# EasyEDA Pro project ProPrj_CAR BY HAO V1.3(no osd)_2026-07-17.epro, board PCB1
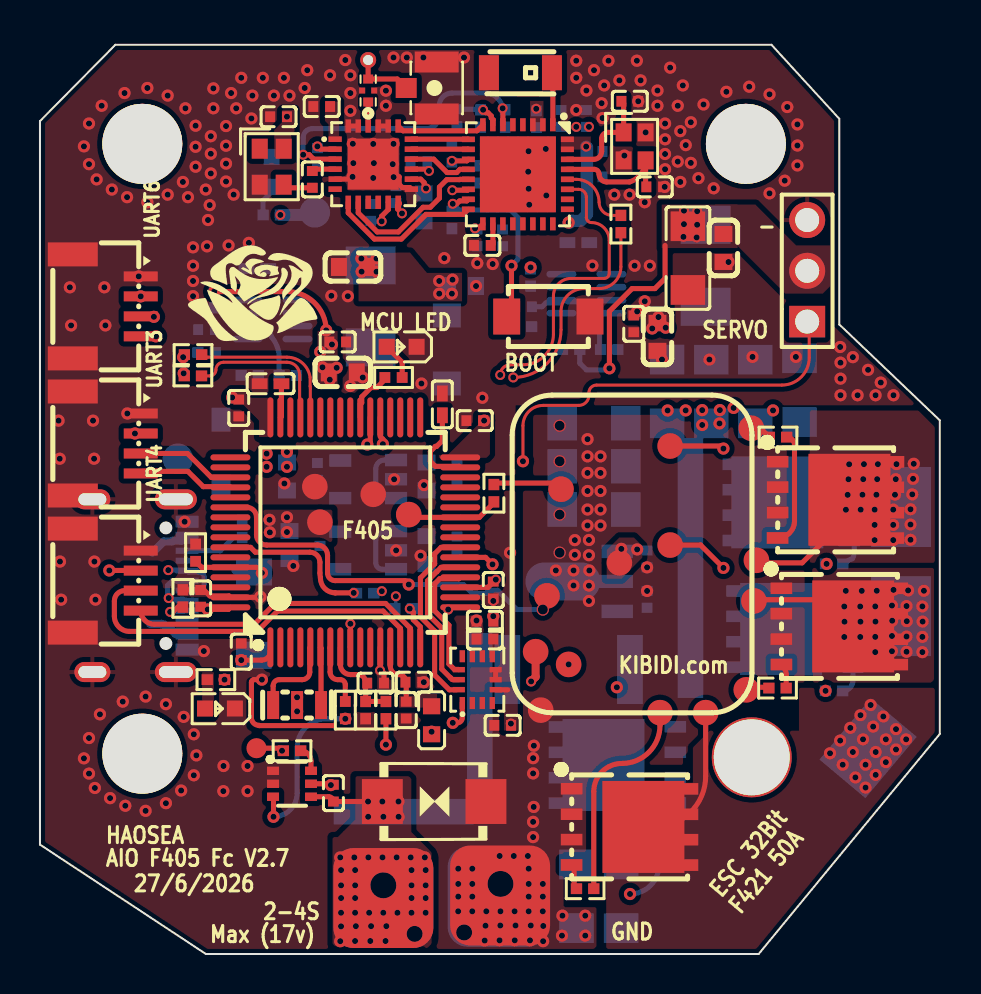
[diagram p6: board, top side]
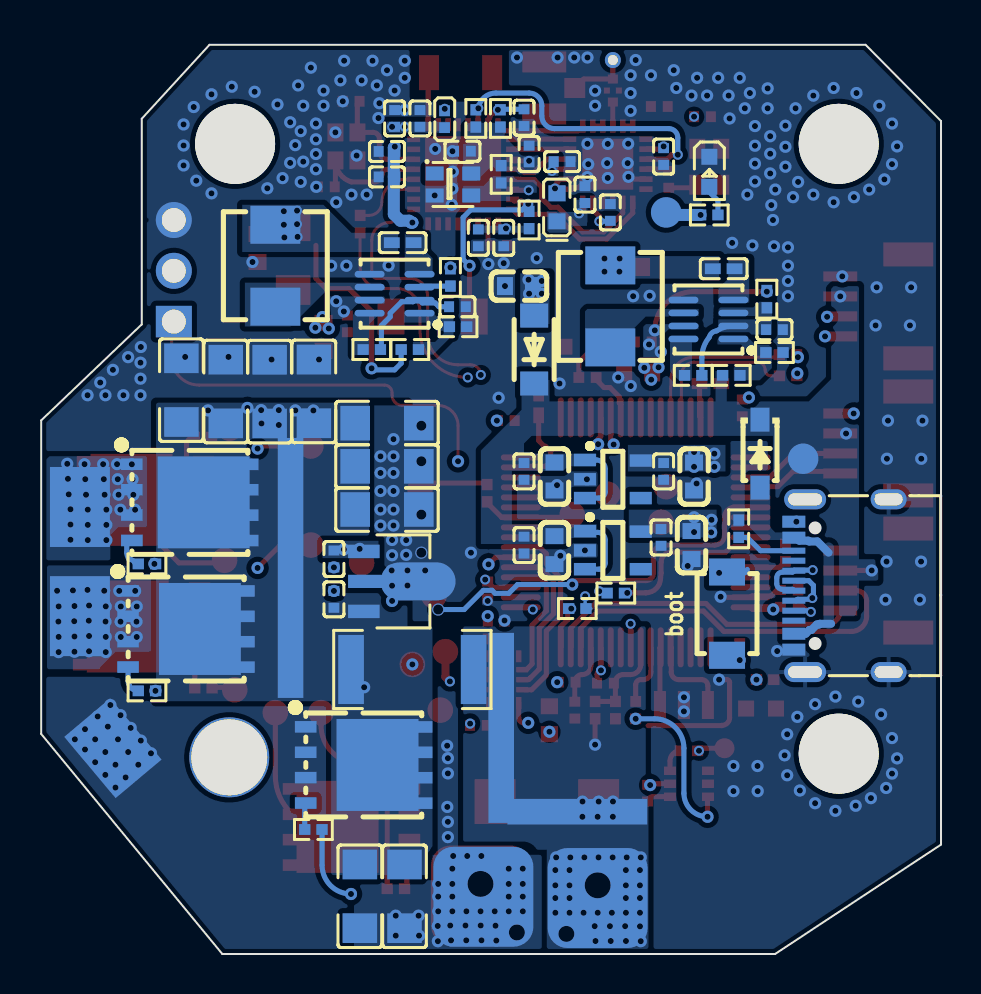
[diagram p7: board, bottom side, seen from below]

Outline 45.03 x 45.47 mm; copper layers: Top Layer, L2, L3, Bottom Layer. Coordinates in mm from the lower left corner of the outline.
Outline path: 0,41.66 3.77,45.47 36.61,45.47 40,41.77 40,31.49 45.03,26.69 45.03,11.01 35.97,0 8.3,0 0,5.47 0,41.66
Stack: Top Layer 0.035mm Outer layer thickness 1oz / Dielectric1 0.2104mm 7628 RC49% 8.6mil / L2 0.0152mm Inner layer thickness / Dielectric2 1.065mm 1.1mm H/HOZ Copper / L3 0.0152mm Inner layer thickness / Dielectric3 0.2104mm 7628 RC49% 8.6mil / Bottom Layer 0.035mm Outer layer thickness 1oz

## Design rules (mm)
template: Custom Config
spacing copperThickness1oz (default): track to track 0.102, other pairs 0.152 to 0.3
spacing copperThickness2oz: track to track 0.203, other pairs 0.152 to 0.3
track width copperThickness1oz (default): min 0.127, default 0.254, max 2.54
track width copperThickness2oz: min 0.203, default 0.254, max 2.54
differential pair differentialPair (default): width min 0.127, default 0.254, max 2.54; gap min 0.152, default 0.152
via viaSize (default): diameter min 0.5, default 0.61, max 10; hole min 0.3, default 0.305, max 6.3
net 4V-MCU uses PHU 100
net GND uses PHU 100
net VM uses PHU 100
net VS1 uses PHU 100
net VS2 uses PHU 100
net VS3 uses PHU 100
net 3.3V-MCU uses PHU 100
net VBAT uses PHU 100
net 3.3V-ESP32 uses PHU 100
pour e1156 uses PHU 100

## Placement (name value [footprint] x y rotation side)
AE1  2450AT18A100E  [ANT-SMD_L3.2-W1.6]  24.04 44.07 180 top
C8  22uf  [C1206]  27.73 22.23 0 bottom
C9  22uf  [C1206]  27.73 24.39 0 bottom
C10  22uf  [C1206]  38.01 28.2 270 bottom
C11  22uf  [C1206]  31.39 28.14 270 bottom
C12  22uf  [C1206]  33.6 28.13 270 bottom
C14  100nF  [C0402]  22.69 18.21 270 top
C17  100nF  [C0402]  14.01 20.83 270 bottom
C18  1nF  [C0402]  14.68 8.05 270 top
C19  100nF  [C0402]  16.79 13.55 0 top
C23  100nF  [C0402]  18.96 39.63 180 bottom
C24  10uF  [C0402]  27.35 41.79 90 bottom
C25  100nF  [C0402]  20.61 40.01 270 bottom
C26  10uF  [C0402]  27.73 38.87 0 bottom
C27  100nF  [C0402]  11.94 41.88 180 top
C28  1uF  [C0402]  20.87 41.83 270 bottom
C31  100nF  [C0402]  27.73 40.14 0 bottom
C32  1uF  [C0402]  22.14 35.44 180 top
C51  1uF  [C0402]  18.33 12.2 90 top
C52  100nF  [C0402]  18.71 13.59 180 top
C53  2.2uF  [C0402]  22.27 16.64 0 top
C54  100nF  [C0402]  23.15 11.44 0 top
C56  100nF  [C0402#2]  20.14 27.49 90 top
C57  100nF  [C0402#2]  11.54 28.52 180 top
C58  100nF  [C0402]  9.95 27.31 270 top
C59  100nF  [C0402]  21.76 26.68 180 top
C60  100nF  [C0402]  10.07 15.12 90 top
C61  100nF  [C0402]  8.04 17.79 90 top
C62  10nF  [C0402]  14.1 42.38 180 top
C63  100nF  [C0402]  26.08 41.79 90 bottom
C64  100nF  [C0402]  21.88 35.82 270 bottom
C65  470nF  [C0402]  17.82 37.98 90 bottom
C66  10nF  [C0402]  13.88 39.88 90 bottom
C72  22uf  [C1206]  26.85 2.89 90 bottom
C73  22uF  [C0603]  19.34 20.2 90 bottom
C74  22uF  [C0603]  12.36 23.88 90 bottom
C79  22uF  [C0603]  12.49 20.45 90 bottom
C80  22uF  [C0603]  19.34 23.88 90 bottom
C81  22uF  [C0603]  15.15 29.09 0 top
C82  22uf  [C1206]  35.8 28.13 270 bottom
C87  22uF  [C0603]  15.66 34.36 180 top
C91  100nF  [C0402]  20.87 24.14 270 bottom
C92  100nF  [C0402]  20.87 20.45 270 bottom
C96  10pF  [C0402]  29.52 42.65 180 top
C97  10pF  [C0402]  30.77 38.37 0 top
C98  10pF  [C0402]  13.63 38.74 90 top
C99  100nF  [C0402]  13.88 24.14 90 bottom
C101  100nF  [C0402#2]  10.88 34.27 180 bottom
C102  22uf  [C1206]  32.43 34.8 90 top
C104  22uF  [C0603]  30.9 30.87 270 top
C105  22uF  [C0603]  34.2 35.31 270 top
C107  100nF  [C0402#2]  26.94 35.58 180 bottom
C116  100nF  [C0402]  8.34 31.23 180 bottom
C117  100nF  [C0402]  22.27 15.75 180 top
C118  100nF  [C0402]  16.55 37.09 90 bottom
C119  100nF  [C0402]  29.71 31.52 90 top
C120  100nF  [C0402]  24.2 32.37 180 bottom
C121  100nF  [C0402]  14.9 30.61 180 top
C122  22uF  [C0603]  21.12 33.41 0 bottom
C124  1uf  [C0402]  30.38 19.76 270 bottom
C125  1uf  [C0402]  30.38 17.74 90 bottom
C126  22uf  [C1206]  27.73 26.55 0 bottom
C127  22uf  [C1206]  29.08 2.89 90 bottom
C128  10uF  [C0402]  23.15 35.82 270 bottom
C129  100nF  [C0402]  23.95 40.15 180 bottom
D5  DSK34  [SOD-123FL_L2.8-W1.9-LS3.7-RD]  20.36 30.23 90 bottom
D6  SMBJ17CA-E3/52  [SMB_L4.3-W3.6-LS5.4-BI]  19.73 7.63 180 top
FL1  2450FM07D0034T  [FILTER-SMD_4P-L1.0-W0.5-L]  16.42 43.19 90 top
H3  2.54-1*3  [HDR-TH_3P-P2.54-V-M-1]  38.39 34.17 90 top
L2  2.2uH  [L0402]  24.84 41.75 90 bottom
L8  15uH  [L0603-RD]  19.22 37.34 90 bottom
L10  6.7uH  [IND-SMD_L5.4-W5.2_FXL0530]  16.55 32.39 90 bottom
L11  10uH  [IND-SMD_L5.4-W5.2_FXL0530]  33.31 34.42 90 bottom
LED3  HSMD-C190  [LED0603-RD]  11.6 39.12 270 bottom
LED4  HSMD-C190  [LED0603-RD]  9.01 12.28 180 top
LED6  HSMD-C190  [LED0603-RD]  18.1 30.37 180 top
LED8  WS2812B-2020  [LED-SMD_4P-L2.0-W2.0-TL_WS2812B-2020]  24.42 38.49 180 bottom
NOREF  -  [Pad_e167]  6.9 24.77 0 top
NOREF#2  -  [Pad_e970]  43.09 22.36 0 top
NOREF#3  -  [Pad_e3454]  35.6 26.29 0 top
NOREF#4  -  [Pad_e3469]  31.03 12.07 0 top
NOREF#5  -  [Pad_e705]  5.12 10.02 0 top
NOREF#6  -  [Pad_e3929]  33.31 12.07 0 top
NOREF#7  -  [Pad_e1906]  17.19 2.8 0 top
NOREF#8  -  [Pad_e1661]  29 19.56 0 top
NOREF#9  -  [Pad_e4614]  16.42 44.71 0 top
NOREF#10  -  [Pad_e4187]  31.54 25.41 0 top
NOREF#11  -  [Pad_e1555]  32.55 19.31 0 top
NOREF#12  -  [Pad_e3452]  35.35 13.21 0 top
NOREF#13  -  [Pad_e1013]  10.84 10.29 0 top
NOREF#14  -  [Pad_e973]  43.09 16.9 0 top
NOREF#15  -  [Pad_e6401]  16.68 22.99 0 top
NOREF#16  -  [Pad_e197]  18.2 7.12 90 top
NOREF#17  -  [Pad_e583]  14.01 21.6 0 top
NOREF#18  -  [Pad_e708]  35.62 9.84 0 top
NOREF#19  -  [Pad_e715]  5.12 40.52 0 top
NOREF#20  -  [Pad_e169]  13.76 37.09 0 top
NOREF#21  -  [Pad_e6085]  25.37 17.91 0 top
NOREF#22  -  [Pad_e1]  24.81 15.12 0 top
NOREF#23  -  [Pad_e2]  17.19 2.8 0 top
NOREF#24  -  [Pad_e4189]  26.46 14.48 0 top
NOREF#25  -  [Pad_e3930]  35.73 17.66 0 top
NOREF#26  -  [Pad_e4540]  25.06 12.2 0 top
NOREF#27  -  [Pad_e1562]  22.01 11.31 0 top
NOREF#28  -  [Pad_e709]  35.33 40.52 0 top
NOREF#29  -  [Pad_e582]  13.76 23.37 0 top
NOREF#30  -  [Pad_e254]  41.44 10.29 140 top
NOREF#31  -  [Pad_e3931]  35.85 19.69 0 top
NOREF#32  -  [Pad_e0]  23.03 2.93 0 top
NOREF#33  -  [Pad_e1907]  22.9 2.86 0 top
NOREF#34  -  [Pad_e4188]  31.54 20.45 0 top
NOREF#35  -  [Pad_e7742]  26.08 23.25 0 top
NOREF#36  -  [Pad_e6272]  18.46 21.98 0 top
Q7  AON6512  [PDFN-8_L5.6-W5.2-P1.27-LS6.1-BL#2]  37.59 22.59 270 bottom
Q8  AON6512  [PDFN-8_L5.6-W5.2-P1.27-LS6.1-BL]  37.78 16.25 270 bottom
Q9  AON6512  [PDFN-8_L5.6-W5.2-P1.27-LS6.1-BL]  28.89 9.45 270 bottom
Q10  AON6512  [PDFN-8_L5.6-W5.2-P1.27-LS6.1-BL]  29.5 6.36 270 top
Q11  AON6512  [PDFN-8_L5.6-W5.2-P1.27-LS6.1-BL]  40 16.38 270 top
Q12  AON6512  [PDFN-8_L5.6-W5.2-P1.27-LS6.1-BL]  39.81 22.71 270 top
R1  10  [R0402]  39.74 19.51 0 bottom
R2  10  [R0402]  39.74 13.16 0 bottom
R3  10  [R0402]  31.41 6.23 0 bottom
R4  10  [R0402]  36.93 25.85 0 top
R5  10  [R0402]  36.91 13.3 0 top
R6  10  [R0402]  27.28 3.27 180 top
R16  1K  [R0402]  22.72 23.05 90 top
R17  1mΩ  [R2512]  26.46 14.23 0 bottom
R18  10K  [R0402]  12.61 10.17 180 top
R20  1k  [R0402]  16.3 12.2 90 top
R21  10k  [R0402]  17.31 12.2 90 top
R26  10K  [R0402]  23.28 41.79 270 bottom
R27  10K  [R0402]  22.05 41.79 270 bottom
R35  10K  [R0402]  8.34 30.08 0 bottom
R36  51K  [R0402]  10.5 28.94 180 bottom
R37  1K  [R0402]  11.6 36.96 0 bottom
R40  10K  [0402]  15.28 12.2 270 top
R41  10K  [R0402]  7.15 17.79 270 top
R42  10K  [R0402]  10.13 21.27 90 bottom
R43  1K  [0402]  17.69 28.83 0 top
R44  10K  [0402]  7.79 20.07 90 top
R47  10K  [R0402]  7.66 29.98 0 top
R48  10K  [R0402]  7.65 28.91 0 top
R53  10K  [R0402]  20.61 36.71 90 bottom
R57  100K  [R0402]  8.72 32.75 90 bottom
R58  100K  [R0402]  12.4 28.94 0 bottom
R59  10K  [R0402]  24.17 31.37 0 bottom
R60  51K  [R0402]  26.58 30.23 180 bottom
R61  100K  [R0402]  24.55 33.84 90 bottom
R62  100K  [R0402]  28.49 30.23 0 bottom
R63  1K  [R0402]  8.8 13.72 0 top
R64  22  [R0402]  29.07 36.51 270 top
R65  22  [R0402]  18.2 17.28 0 bottom
R66  22  [R0402]  16.28 18.05 0 bottom
R67  10K  [R0402]  22.01 38.99 90 bottom
RF1  6GHz  [IPEX-SMD_3P-L2.6-W2.6-LS3.0_RF1200001R]  19.09 43.31 90 top
SW1  Ferrite Bead 0603  [L0603]  19.6 11.69 90 top
SW2  K2-1807SN-B4DW-06  [SW-SMD_L4.0-W2.9-LS4.8-2]  10.71 17.02 270 bottom
SW3  K2-1807SN-B4DW-06  [SW-SMD_L4.0-W2.9-LS4.8-2]  25.44 31.88 0 top
U29  INA199A1DCKR  [SC-70-6_L2.2-W1.3-P0.65-LS2.1-BR]  12.61 8.51 180 top
U35  ESP32-C3  [QFN-32_L5.0-W5.0-P0.50-TL-EP3.7]  23.92 38.99 270 top
U38  AP2112K  [SOT-25-5_L3.0-W1.8-P0.95-LS3.0-BR]  16.42 23.75 0 bottom
U40  AP2112K  [SOT-25-5_L3.0-W1.8-P0.95-LS3.0-BR]  16.42 20.2 0 bottom
U42  STM32F405RGT6  [LQFP-64_L10.0-W10.0-P0.50-LS12.0-BL]  15.28 21.09 0 top
U43  BMI270  [LGA-14_L3.0-W2.5-P0.50-BR]  21.88 13.72 270 top
U52  SX1280IMLTRT  [QFN-24_L4.0-W4.0-P0.50-BL-EP2.6]  16.68 39.5 270 top
U53  TYPE C-ZL-102PWB  [TYPE-C-SMD_HDGC_TYPE-C-ZL-103PWB]  4.99 18.42 90 bottom
U55  1N5819W  [SOD-123_L2.7-W1.6-LS3.7-RD-1]  9.06 25.02 270 bottom
U57  52MHz  [OSC-SMD_4P-L2.0-W1.6-BL]  11.6 39.38 270 top
U58  MP9943GQ(TOKMAS)  [QFN-8_L3.0-W3.0-P0.65-BL]  11.64 31.73 90 bottom
U59  MP9943GQ(TOKMAS)  [QFN-8_L3.0-W3.0-P0.65-BL]  27.35 33.03 90 bottom
U67  SL78L10  [SOT-89-3_L4.5-W2.5-P1.50-LS4.2-BR]  27.53 18.64 0 bottom
UART3  UART4  [CONN-SMD_4P-P1.00_MEGASTAR_ZX-SH1.0-4PWT]  3.34 25.53 270 top
UART4  UART6  [CONN-SMD_4P-P1.00_MEGASTAR_ZX-SH1.0-4PWT]  3.34 18.67 270 top
UART6  UART6  [CONN-SMD_4P-P1.00_MEGASTAR_ZX-SH1.0-4PWT]  3.34 32.39 270 top
X1  40MHz  [CRYSTAL-SMD_4P-L2.0-W1.6-BL]  29.76 40.39 270 top
X2  8MHz  [OSC-SMD_3P-L3.2-W1.3-P1.20-L]  12.87 12.45 0 top

## Footprints (pads in the part's own frame, mm; a bottom-side part is the same pattern mirrored in y, then rotated)
0402
  rect 0.541x0.54 smd: 1(-0.433,0) 2(0.433,0)
ANT-SMD_L3.2-W1.6
  rect 1x1.75 smd: 1(-1.578,0) 2(1.578,0)
C0402
  rect 0.5x0.54 smd: 1(-0.42,0) 2(0.42,0)
C0402#2
  rect 0.79x0.54 smd: 1(-0.545,0) 2(0.545,0)
C0603
  rect 0.8x0.9 smd: 1(-0.7,0) 2(0.7,0)
C1206
  rect 1.485x1.728 smd: 1(-1.593,0) 2(1.593,0)
CONN-SMD_4P-P1.00_MEGASTAR_ZX-SH1.0-4PWT
  rect 0.5x1.7 smd: 1(-1.5,1.7) 2(-0.5,1.7) 3(0.5,1.7) 4(1.5,1.7)
  rect 1.2x2.5 smd: 5(2.6,-1.7) 6(-2.6,-1.7)
CRYSTAL-SMD_4P-L2.0-W1.6-BL
  rect 0.9x0.8 smd: 1(-0.7,-0.55) 2(0.7,-0.55) 3(0.7,0.55) 4(-0.7,0.55)
FILTER-SMD_4P-L1.0-W0.5-L
  rect 0.45x0.5 smd: 1(-0.575,0) 3(0.575,0)
  rect 0.3x0.3 smd: 2(0,-0.3) 4(0,0.3)
HDR-TH_3P-P2.54-V-M-1
  rect 1.575x1.8 hole 1.2: 1(-2.54,0)
  round 1.8 hole 1.2: 2(0,0) 3(2.54,0)
IND-SMD_L5.4-W5.2_FXL0530
  rect 1.9x2.5 smd: 1(-2.05,0) 2(2.05,0)
IPEX-SMD_3P-L2.6-W2.6-LS3.0_RF1200001R
  rect 1x1.05 smd: 1(0,0.762)
  rect 1.05x2.2 smd: 2(-1.3,-0.762) 3(1.3,-0.762)
L0402
  rect 0.54x0.54 smd: 1(-0.42,0) 2(0.42,0)
L0603
  rect 0.8x0.864 smd: 1(-0.7,0) 2(0.7,0)
L0603-RD
  rect 0.8x0.864 smd: 1(-0.7,0) 2(0.7,0)
LED0603-RD
  rect 0.8x0.8 smd: 1(-0.749,0) 2(0.749,0)
LED-SMD_4P-L2.0-W2.0-TL_WS2812B-2020
  rect 0.9x0.7 smd: 1(-0.915,0.55) 2(-0.915,-0.55) 3(0.915,-0.55) 4(0.915,0.55)
LGA-14_L3.0-W2.5-P0.50-BR
  rect 0.6x0.27 smd: 1(1.17,-0.75) 2(1.17,-0.25) 3(1.17,0.25) 4(1.17,0.75) 8(-1.17,0.75) 9(-1.17,0.25) 10(-1.17,-0.25) 11(-1.17,-0.75)
  rect 0.27x0.6 smd: 5(0.5,0.92) 6(0,0.92) 7(-0.5,0.92) 12(-0.5,-0.92) 13(0,-0.92) 14(0.5,-0.92)
LQFP-64_L10.0-W10.0-P0.50-LS12.0-BL
  oval 0.3x2 smd: 1(-3.75,-5.75) 2(-3.25,-5.75) 3(-2.75,-5.75) 4(-2.25,-5.75) 5(-1.75,-5.75) 6(-1.25,-5.75) 7(-0.75,-5.75) 8(-0.25,-5.75) 9(0.25,-5.75) 10(0.75,-5.75) 11(1.25,-5.75) 12(1.75,-5.75) 13(2.25,-5.75) 14(2.75,-5.75) 15(3.25,-5.75) 16(3.75,-5.75) 33(3.75,5.75) 34(3.25,5.75) 35(2.75,5.75) 36(2.25,5.75) 37(1.75,5.75) 38(1.25,5.75) 39(0.75,5.75) 40(0.25,5.75) 41(-0.25,5.75) 42(-0.75,5.75) 43(-1.25,5.75) 44(-1.75,5.75) 45(-2.25,5.75) 46(-2.75,5.75) 47(-3.25,5.75) 48(-3.75,5.75)
  oval 2x0.3 smd: 17(5.75,-3.75) 18(5.75,-3.25) 19(5.75,-2.75) 20(5.75,-2.25) 21(5.75,-1.75) 22(5.75,-1.25) 23(5.75,-0.75) 24(5.75,-0.25) 25(5.75,0.25) 26(5.75,0.75) 27(5.75,1.25) 28(5.75,1.75) 29(5.75,2.25) 30(5.75,2.75) 31(5.75,3.25) 32(5.75,3.75) 49(-5.75,3.75) 50(-5.75,3.25) 51(-5.75,2.75) 52(-5.75,2.25) 53(-5.75,1.75) 54(-5.75,1.25) 55(-5.75,0.75) 56(-5.75,0.25) 57(-5.75,-0.25) 58(-5.75,-0.75) 59(-5.75,-1.25) 60(-5.75,-1.75) 61(-5.75,-2.25) 62(-5.75,-2.75) 63(-5.75,-3.25) 64(-5.75,-3.75)
OSC-SMD_3P-L3.2-W1.3-P1.20-L
  rect 0.6x1.4 smd: 1(-1.199,0) 2(0,0) 3(1.199,0)
OSC-SMD_4P-L2.0-W1.6-BL
  rect 1x0.8 smd: 1(-0.9,-0.6) 2(0.9,-0.6) 3(0.9,0.6) 4(-0.9,0.6)
Pad_e0
  rrect 5x5 smd: 1(0,0)
Pad_e1
  round 1.282 smd: 1(0,0)
Pad_e2
  rrect 5x5 smd: 1(0,0)
Pad_e167
  round 1.524 smd far side: 1(0,0)
Pad_e169
  round 1.524 smd far side: 1(0,0)
Pad_e197
  rect 1.282x7 smd far side: 1(0,0)
Pad_e254
  rect 3x4 smd far side: 1(0,0)
Pad_e582
  round 1.282 smd: 1(0,0)
Pad_e583
  round 1.282 smd: 1(0,0)
Pad_e705
  round 4 hole 4: 4(0,0)
Pad_e708
  round 4 hole 3.8: 4(0,0)
Pad_e709
  round 4 hole 4: 4(0,0)
Pad_e715
  round 4 hole 4: 4(0,0)
Pad_e970
  rect 3x4 smd far side: 1(0,0)
Pad_e973
  rect 3x4 smd far side: 1(0,0)
Pad_e1013
  round 1 smd: 1(0,0)
Pad_e1555
  rect 1.282x13 smd far side: 1(0,0)
Pad_e1562
  rect 1.282x9.5 smd far side: 1(0,0)
Pad_e1661
  round 1.282 smd: 1(0,0)
Pad_e1906
  rrect 5x5 smd far side: 1(0,0)
Pad_e1907
  rrect 5x5 smd far side: 1(0,0)
Pad_e3452
  round 1.282 smd: 1(0,0)
Pad_e3454
  round 1.282 smd: 1(0,0)
Pad_e3469
  round 1.282 smd: 1(0,0)
Pad_e3929
  round 1.282 smd: 1(0,0)
Pad_e3930
  round 1.282 smd: 1(0,0)
Pad_e3931
  round 1.282 smd: 1(0,0)
Pad_e4187
  round 1.282 smd: 1(0,0)
Pad_e4188
  round 1.282 smd: 1(0,0)
Pad_e4189
  round 1.282 smd: 1(0,0)
Pad_e4540
  round 1.282 smd: 1(0,0)
Pad_e4614
  round 0.8 hole 0.5: 1(0,0)
Pad_e6085
  round 1.282 smd: 1(0,0)
Pad_e6272
  round 1.282 smd: 1(0,0)
Pad_e6401
  round 1.282 smd: 1(0,0)
Pad_e7742
  round 1.282 smd: 1(0,0)
PDFN-8_L5.6-W5.2-P1.27-LS6.1-BL
  rect 0.58x1.079 smd: 1(-1.907,-2.9) 2(-0.637,-2.9) 3(0.632,-2.9) 4(1.903,-2.9)
  rect 0.58x1.08 smd: 5(1.907,2.9) 6(0.637,2.9) 7(-0.632,2.9) 8(-1.903,2.9)
  rect 4.6x4.1 smd: 9(-0.003,0.695)
PDFN-8_L5.6-W5.2-P1.27-LS6.1-BL#2
  rect 0.58x1.079 smd: 1(-1.907,-2.9) 2(-0.637,-2.9) 3(0.632,-2.9) 4(1.903,-2.9)
  rect 0.58x1.08 smd: 5(1.907,2.9) 6(0.637,2.9) 7(-0.632,2.9) 8(-1.903,2.9)
  rect 4.6x4.6 smd: 9(-0.003,0.695)
QFN-8_L3.0-W3.0-P0.65-BL
  oval 0.33x1.5 smd: 1(-0.975,-1.25) 2(-0.325,-1.25) 3(0.325,-1.25) 4(0.975,-1.25) 5(0.975,1.25) 6(0.325,1.25) 7(-0.325,1.25) 8(-0.975,1.25)
QFN-24_L4.0-W4.0-P0.50-BL-EP2.6
  rect 0.28x0.665 smd: 1(-1.25,-1.907) 2(-0.75,-1.907) 3(-0.25,-1.907) 4(0.25,-1.907) 5(0.75,-1.907) 6(1.25,-1.907) 13(1.25,1.907) 14(0.75,1.907) 15(0.25,1.907) 16(-0.25,1.907) 17(-0.75,1.907) 18(-1.25,1.907)
  rect 0.665x0.28 smd: 7(1.907,-1.25) 8(1.907,-0.75) 9(1.907,-0.25) 10(1.907,0.25) 11(1.907,0.75) 12(1.907,1.25) 19(-1.907,1.25) 20(-1.907,0.75) 21(-1.907,0.25) 22(-1.907,-0.25) 23(-1.907,-0.75) 24(-1.907,-1.25)
  rect 2.55x2.55 smd: 25(0,0)
QFN-32_L5.0-W5.0-P0.50-TL-EP3.7
  rect 0.65x0.28 smd: 1(-2.478,1.75) 2(-2.478,1.25) 3(-2.478,0.75) 4(-2.478,0.25) 5(-2.478,-0.25) 6(-2.478,-0.75) 7(-2.478,-1.25) 8(-2.478,-1.75) 17(2.478,-1.75) 18(2.478,-1.25) 19(2.478,-0.75) 20(2.478,-0.25) 21(2.478,0.25) 22(2.478,0.75) 23(2.478,1.25) 24(2.478,1.75)
  rect 0.28x0.65 smd: 9(-1.75,-2.478) 10(-1.25,-2.478) 11(-0.75,-2.478) 12(-0.25,-2.478) 13(0.25,-2.478) 14(0.75,-2.478) 15(1.25,-2.478) 16(1.75,-2.478) 25(1.75,2.478) 26(1.25,2.478) 27(0.75,2.478) 28(0.25,2.478) 29(-0.25,2.478) 30(-0.75,2.478) 31(-1.25,2.478) 32(-1.75,2.478)
  rect 3.8x3.8 smd: 33(0,0)
R0402
  rect 0.566x0.54 smd: 1(-0.433,0) 2(0.433,0)
R2512
  rect 1.282x3.456 smd: 1(-3.067,0) 2(3.067,0)
SC-70-6_L2.2-W1.3-P0.65-LS2.1-BR
  rect 0.6x0.42 smd: 1(0.95,-0.65) 2(0.95,0) 3(0.95,0.65) 4(-0.95,0.65) 5(-0.95,0) 6(-0.95,-0.65)
SMB_L4.3-W3.6-LS5.4-BI
  rect 2.047x2.241 smd: 1(-2.591,0) 2(2.591,0)
SOD-123_L2.7-W1.6-LS3.7-RD-1
  rect 1.2x0.95 smd: 1(-1.7,0) 2(1.7,0)
SOD-123FL_L2.8-W1.9-LS3.7-RD
  rect 1.2x1.4 smd: 1(-1.7,0) 2(1.7,0)
SOT-25-5_L3.0-W1.8-P0.95-LS3.0-BR
  rect 1.105x0.623 smd: 1(1.397,-0.953) 2(1.397,0.013) 3(1.397,0.953) 4(-1.397,0.953) 5(-1.397,-0.927)
SOT-89-3_L4.5-W2.5-P1.50-LS4.2-BR
  rect 1.575x0.672 smd: 1(1.356,-1.5) 3(1.356,1.5)
  custom 5.377x1.9 smd: 2(-1.356,0)
SW-SMD_L4.0-W2.9-LS4.8-2
  rect 1.35x1.8 smd: 1(-2.083,0) 2(2.083,0)
TYPE-C-SMD_HDGC_TYPE-C-ZL-103PWB
  oval 1x2.1 hole 0.6x1.7: 12(-4.32,1.808) 13(4.32,1.808)
  oval 1x1.8 hole 0.6x1.4: 14(-4.32,-2.373) 15(4.32,-2.373)
  rect 0.6x1.15 smd: A1B12(-3.2,2.373) A4B9(-2.4,2.373) A9B4(2.4,2.373) A12B1(3.2,2.373)
  rect 0.3x1.15 smd: A5(-1.25,2.373) A6(-0.25,2.373) A7(0.25,2.373) A8(1.25,2.373) B5(1.75,2.373) B6(0.75,2.373) B7(-0.75,2.373) B8(-1.75,2.373)

## Nets
3.3V-ESP32: C23.1 C24.1 C25.2 C26.1 C27.1 C31.1 C63.1 C64.1 C74.2 C99.2 C118.1 C128.1 C129.2 L2.1 LED8.4 NOREF#20.1 R26.2 R27.2 R37.2 R53.1 R67.2 U35.11 U35.17 U35.31 U35.32 U38.5 U52.11 U52.15 U57.4
3.3V-MCU: C14.1 C17.1 C53.2 C54.2 C58.1 C59.1 C60.1 C61.1 C79.2 C117.1 NOREF#17.1 NOREF#22.1 R40.2 R63.2 SW1.1 SW2.2 U29.3 U40.5 U42.1 U42.19 U42.32 U42.48 U42.64 U43.5 U43.8
4V-MCU: C73.2 C80.2 C91.1 C92.1 D5.1 NOREF.1 R36.1 U38.1 U38.3 U40.1 U40.3 U55.1 UART3.2 UART4.2 UART6.2
6V-SV: C102.2 C105.1 C107.1 H3.2 L11.2 R60.1
8V: C124.1 NOREF#8.1 U67.1
GND: C8.1 C9.1 C10.1 C11.1 C12.1 C14.2 C17.2 C19.2 C23.2 C24.2 C25.1 C26.2 C27.2 C28.2 C31.2 C32.2 C51.1 C52.1 C53.1 C54.1 C56.2 C57.2 C58.2 C59.2 C60.2 C61.2 C62.2 C63.2 C64.2 C65.2 C66.1 C72.1 C73.1 C74.1 C79.1 C80.1 C81.2 C82.1 C87.2 C91.2 C92.2 C96.1 C97.2 C99.1 C102.1 C104.2 C105.2 C116.2 C117.2 C118.2 C119.1 C120.2 C121.1 C122.2 C124.2 C125.2 C126.1 C127.1 C128.2 C129.1 D6.1 FL1.2 FL1.4 H3.3 LED3.1 LED4.1 LED6.1 LED8.2 NOREF#15.1 NOREF#18.4 NOREF#26.1 NOREF#29.1 NOREF#32.1 NOREF#33.1 Q10.1 Q10.2 Q10.3 Q11.1 Q11.2 Q11.3 Q12.1 Q12.2 Q12.3 R20.1 R35.1 R41.1 R42.2 R44.2 R59.1 RF1.2 RF1.3 SW3.2 U29.1 U29.2 U35.33 U38.2 U40.2 U42.12 U42.18 U42.63 U43.6 U43.7 U52.5 U52.13 U52.20 U52.21 U52.23 U52.24 U52.25 U53.12 U53.13 U53.14 U53.15 U53.A1B12 U53.A12B1 U57.2 U58.5 U59.5 U67.2 UART3.1 UART3.5 UART3.6 UART4.1 UART4.5 UART4.6 UART6.1 UART6.5 UART6.6 X1.2 X1.4 X2.2
VBAT: C18.2 D6.2 NOREF#7.1 NOREF#16.1 NOREF#23.1 NOREF#27.1 R17.1 R21.1 U29.4
ADC_CURRENT: NOREF#13.1 R18.2 U42.9
BUSY: U35.16 U52.7
COI: U42.25
D+: R48.1 U53.A6 U53.B6
D-: R47.1 U53.A7 U53.B7
DIO1: U35.13 U52.8
ELRS_AT: FL1.3 NOREF#9.1 RF1.1
ESCINPCB: NOREF#36.1 R16.1 U42.26
ESPD+: U35.26
ESPD-: U35.25
GIRO_MOSI: U42.23 U43.14
GYRO_CS: U42.20 U43.12
GYRO_INT: U42.24 U43.4
GYRO_MISO: U42.22 U43.1
GYRO_SCK: U42.21 U43.13
HO1: NOREF#10.1 R1.1
HO2: NOREF#34.1 R2.1
HO3: NOREF#24.1 R3.1
LED: LED8.3 R67.1 U35.14
LO1: NOREF#3.1 R4.1
LO2: NOREF#12.1 R5.1
LO3: NOREF#4.1 R6.1
MAIN_D+: R48.2 U42.45
MAIN_D-: R47.2 U42.44
MISO: U35.12 U52.16
MOSI: U35.10 U52.17
NRST: R26.1 U35.6 U52.3
NSS: U35.8 U52.19
OSD_CS: U42.33
RX2(ELRS): R64.2 U42.17
RX3: U42.52 UART3.4
RX4: U42.15 UART4.4
RX5(ESC): NOREF#21.1 U42.54
RX6: U42.38 UART6.4
SCK: U35.9 U52.18
SDCARD_CS: U42.50
SERVO: R66.1 U42.58
SPI2_MISO: U42.35
SPI2_MOSI: U42.36
SPI2_SCK: U42.34
TX1(VTX): U42.42
TX2(ELRS): R65.1 U35.27
TX3: U42.51 UART3.3
TX4: U42.14 UART4.3
TX6: U42.37 UART6.3
VM: C8.2 C9.2 C10.2 C11.2 C12.2 C18.1 C72.2 C81.1 C82.2 C104.1 C119.2 C121.2 C125.1 C126.2 C127.2 NOREF#11.1 Q7.5 Q7.6 Q7.7 Q7.8 Q7.9 Q8.5 Q8.6 Q8.7 Q8.8 Q8.9 Q9.5 Q9.6 Q9.7 Q9.8 Q9.9 R17.2 R57.2 R61.2 U29.5 U58.7 U59.7 U67.3
VOL_BAT: C19.1 R20.2 R21.2 U42.8
VS1: NOREF#2.1 NOREF#31.1 Q7.1 Q7.2 Q7.3 Q12.5 Q12.6 Q12.7 Q12.8 Q12.9
VS2: NOREF#14.1 NOREF#25.1 Q8.1 Q8.2 Q8.3 Q11.5 Q11.6 Q11.7 Q11.8 Q11.9
VS3: NOREF#6.1 NOREF#30.1 Q9.1 Q9.2 Q9.3 Q10.5 Q10.6 Q10.7 Q10.8 Q10.9
$1N2538: C51.2 C52.2 SW1.2 U42.13
$1N3159: R40.1 U42.7
$1N3199: C56.1 U42.31
$1N3225: C57.1 U42.47
$1N3354: R44.1 SW2.1 U42.60
$1N3523: U42.6 X2.3
$1N3528: U42.5 X2.1
$1N3909: R41.2 U53.A5
$1N14327: R42.1 U53.B5
$1N15412: LED6.2 R43.2
$1N15413: R43.1 U42.39
$1N25112: R65.2 U42.16
$1N25141: H3.1 R66.2
$1N27338: U53.A4B9 U53.A9B4 U55.2
$2N4139: R18.1 U29.6
$2N14711: LED3.2 R37.1
$2N34434: L10.1 U58.6
$2N34463: R35.2 R36.2 U58.1
$2N35678: C116.1 R58.1 U58.2
$2N36914: R57.1 U58.3
$2N36943: C101.2 U58.4
$2N37015: R58.2 U58.8
$2N37504: C107.2 U59.4
$2N37507: R62.2 U59.8
$2N37520: C120.1 R62.1 U59.2
$2N37529: R59.2 R60.2 U59.1
$2N37530: R61.1 U59.3
$2N37539: L11.1 U59.6
$2N37656: LED4.2 R63.1
$2N43695: C87.1 C101.1 C122.1 D5.2 L10.2
$3N23575: Q7.4 R1.2
$3N23610: Q12.4 R4.2
$3N23669: Q8.4 R2.2
$3N23722: Q11.4 R5.2
$3N23784: Q9.4 R3.2
$3N23789: Q10.4 R6.2
$3N32793: NOREF#35.1 R16.2
$4N1414: AE1.1 U35.1
$4N1415: L2.2 U35.2 U35.3
$4N1425: C28.1 R27.1 U35.7
$4N1429: C96.2 U35.30 X1.1
$4N1434: C97.1 U35.29 X1.3
$4N1450: C32.1 U35.18
$4N8239: C62.1 U52.1
$4N16826: FL1.1 U52.22
$4N18055: R53.2 SW3.1 U35.15
$4N19180: L8.2 U52.14
$4N19324: C65.1 C66.2 L8.1 U52.2 U52.12
$4N19361: C98.2 U52.4
$4N19425: C98.1 U57.3
$4N27786: R64.1 U35.28

Pads without a net: AE1 2; LED8 1; NOREF#5 4; NOREF#19 4; NOREF#28 4; U35 4 5 19 20 21 22 23 24; U38 4; U40 4; U42 2 3 4 10 11 27 28 29 30 40 41 43 46 49 53 55 56 57 59 61 62; U43 2 3 9 10 11; U52 6 9 10; U53 A8 B8; U57 1

## Via types
v1: diameter 0.61, hole 0.305, Top Layer to Bottom Layer, 451 vias
v2: diameter 0.5, hole 0.305, Top Layer to Bottom Layer, 39 vias
v3: diameter 1.4, hole 1.3, Top Layer to Bottom Layer, 2 vias
v4: diameter 0.61, hole 0.5, Top Layer to Bottom Layer, 5 vias
v5: diameter 1, hole 0.8, Top Layer to Bottom Layer, 2 vias
v6: diameter 0.51, hole 0.305, Top Layer to Bottom Layer, 2 vias

## Routing (per net, layer and track width the routed paths; a pad name or vN(x,y) marks a point on that pad's centre or on a via; arc(x,y) is an arc through that point)
3.3V-ESP32: length 16.1
  Top Layer w0.254: v2(17.1,36.64) 17.1,36.9 17.44,37.24 17.44,37.58 U52.11 ; v2(21.77,36.29) 21.94,36.29 U35.17 ; v2(19.47,39.16) 19.38,39.25 U52.15 ; v2(20.61,39.67) 21.36,39.67 U35.11
  L3 w0.5: v2(21.77,36.29) 22.01,36.53 22.01,39.12 21.46,39.67 v2(20.61,39.67) 20.11,39.16 v2(19.47,39.16)
  Bottom Layer w0.254: v2(17.1,36.64) 16.58,36.64 arc(16.56,36.65) C118.1
  Bottom Layer w0.6: v2(27.34,40.38) 27.38,40.33 27.38,37 27.06,36.67 26.62,36.67 26.53,36.58 v1(26.46,36.58) ; v2(12.03,36.96) 13.63,36.96 arc(13.72,37) NOREF#20.1
  vias: v1(11.34,25.02) v1(11.34,24.37) v1(12.36,25.11) v1(12.36,24.37) v2(12.36,41.88) v2(26.84,41.37) v2(27.47,41.37)
3.3V-MCU: length 87.3
  Top Layer w0.254: v2(22.81,18.73) 22.42,18.34 U42.19 ; U42.64 9.43,17.23 v1(8.4,17.23) ; 11.69,6.98 11.69,7.84 arc(11.68,7.86) U29.3 ; 23.41,13.21 22.81,13.21 arc(22.81,13.22) U43.5 ; U42.1 11.53,15.14 arc(11.4,14.83) 11.09,14.7 v1(10.07,14.7)
  Top Layer w0.4: NOREF#22.1 24.81,13.86 v6(24.58,13.63)
  L3 w0.254: 17.95,14.86 17.95,13.59 arc(18.21,12.97) 18.84,12.71 arc(19.38,12.48) 19.6,11.94 v1(19.6,11.12) 19.52,11.19 18.09,11.19 17.52,11.76 v1(15.28,11.76) ; 23.35,14.86 23.35,18.19 arc(23.19,18.57) v2(22.81,18.73) ; v1(22.23,26.68) 22.23,24.38 arc(21.48,22.59) 19.69,21.84 v1(12.36,21.84) ; v1(22.69,16.9) 22.69,14.9 arc(22.67,14.88) 22.65,14.86 ; v6(24.58,13.63) 24.58,12.54 v6(23.57,11.52) ; v1(9.62,27.83) 9.62,22.81 arc(9.94,22.04) 10.71,21.72 arc(10.71,21.72) 10.72,21.72 v1(11.49,21.72) ; v1(8.4,17.23) 8.26,17.38 8.26,18.53 8.27,18.55 arc(9.01,20.34) 10.81,21.09 v1(11.5,21.09) arc(10.49,20.67) 10.07,19.66 v1(10.07,14.7) 10.07,14.56 arc(9.83,13.97) v1(9.24,13.72)
  L3 w0.6: v1(12.36,21.1) arc(12.36,21.09) 12.37,21.09 14.65,21.09 arc(16.08,20.49) 16.68,19.06 16.41,18.78 16.41,16.41 16.68,16.13 arc(17.05,15.24) 17.95,14.86 23.35,14.86 arc(24.22,14.5) v6(24.58,13.63)
  Bottom Layer w0.254: v1(15.28,11.76) 14.34,11.76 arc(13.3,11.33) 12.87,10.29 12.87,8.05 arc(12.52,7.21) v1(11.69,6.86)
4V-MCU: length 8.8
  Top Layer w0.254: v1(3.47,19.18) 5.03,19.18 arc(5.04,19.18) UART4.2
  Bottom Layer w0.254: U40.3 17.12,19.25 arc(16.9,19.34) 16.8,19.56 16.8,20.71 arc(16.92,20.98) 17.19,21.09 17.76,21.09 arc(17.8,21.11) U40.1 ; U38.1 17.25,24.71 arc(16.93,24.58) 16.8,24.26 16.8,23.12 arc(16.9,22.89) 17.12,22.8 U38.3
  vias: v1(4.75,26.03) v1(5.04,32.89)
6V-SV: length 10.3
  Top Layer w0.254: 31.28,35.44 31.28,33.79 30.77,33.28 29.63,33.28 28.5,32.15 v1(28.5,29.29)
  Bottom Layer w0.254: v1(28.5,29.29) 28.42,29.22 27.35,29.22 27.02,29.54 R60.1
  vias: v2(32.23,37.18) v2(32.23,36.5) v2(32.2,35.87) v2(32.89,37.15) v2(32.89,36.47) v2(32.86,35.84)
8V:
  vias: v1(29.09,20.26) v1(29.88,20.23)
GND: length 19.4
  Top Layer w0.254: 7.03,18.22 8.03,18.22 C61.2 8.21,18.21 8.5,17.91 9.46,17.91 U42.63 10.96,17.84 ; 17.31,38.87 17.97,38.87 17.97,38.86 17.97,38.5 18.14,38.33 18.5,38.33 U52.13 ; C19.2 17.21,13.99 arc(17.16,14.13) v2(17.02,14.19) arc(17.03,14.19) 17.03,14.2 U42.12 ; U52.23 U52.24 ; U52.21 U52.20 ; U52.5 15.64,38.75 15.82,38.57 ; v1(11.11,13.72) 10.71,13.72 arc(10.62,13.68) 10.58,13.59 10.58,11.82 arc(10.69,11.55) 10.96,11.44 10.98,11.42 14.66,11.42 ; U43.6 U43.7
  L2 w0.254: C51.1 19.01,11.09 19.01,10.87 19.47,10.42 19.47,9.91
  vias: v1(0.93,26.68) v1(0.99,24.77) v1(1,19.63) v1(1.06,17.72) v1(1.5,33.34) v1(1.56,31.44) v1(2.2,40.39) v1(2.2,9.78) v1(2.45,41.53) v1(2.45,39.5) v1(2.45,10.8) v1(2.45,9.02) v1(2.66,26.68) v1(2.71,24.77) v1(2.73,19.63) v1(2.78,17.72) v1(2.75,8.3) v1(2.83,38.74) v1(3.09,42.42) v1(3,11.99) v1(3.22,33.34) v1(3.27,31.44) v1(3.51,7.8) v1(3.6,38.23) v1(4.14,12.62) v1(4.23,43.06) v1(4.27,7.42) v1(4.36,37.85) v1(4.37,27.03) v1(4.94,33.89) v1(5.29,12.88) v1(5.29,7.16) v1(5.37,43.31) v1(5.37,37.6) v1(6.39,42.93) v1(6.39,37.98) v1(6.3,12.5) v1(6.3,7.54) v1(7.06,8.18) v1(7.15,38.61) v1(7.28,42.3) v1(7.24,21.62) v1(7.19,11.86) v1(7.41,37.85) v1(7.66,35.34) v1(7.66,34.42) v1(7.66,33.66) v1(7.66,32.9) v1(7.79,41.43) v1(7.79,40.37) v1(7.79,39.38) v1(7.7,10.99) v1(7.7,8.94) v1(7.83,9.94) v1(8.2,15.15) v1(8.3,38.23) v1(8.36,35.39) v1(8.41,36.71) v1(8.55,40.9) v1(8.55,40.02) v1(8.55,39.04) v1(8.49,37.45) v1(8.68,43.29) v1(8.68,42.3) v1(9.18,9.4) v1(9.18,8.15) v1(9.31,41.41) v1(9.31,40.42) v1(9.31,39.53) v1(9.31,38.63) v1(9.44,35.44) v1(9.57,43.06) v1(9.69,37.98) v1(9.82,42.3) v1(10.07,43.82) v1(10.39,9.4) v1(10.39,8.15) v1(10.45,35.57) v1(10.58,41.79) v1(10.63,42.93) v1(11.03,17.87) v1(11.15,43.82) v1(11.71,42.93) v1(12.21,43.82) v1(12.23,23.53) v1(12.49,42.93) v1(12.68,19.41) v1(12.87,12.84) v1(12.87,12.14) v1(13.25,43.31) v1(13.38,44.2) v1(14.52,43.95) v1(14.58,32.92) v1(15.28,44.71) v1(15.41,32.9) v1(15.53,43.95) v1(15.53,43.06) v1(15.53,42.17) v1(15.53,28.41) v1(15.66,40.52) v1(15.68,39.55) v1(15.64,38.87) v1(16.15,28.83) v1(16.68,40.51) v1(16.68,38.81) v1(16.71,39.55) v1(17.31,43.18) v1(17.31,42.42) v1(17.65,39.5) v1(17.69,44.84) v1(17.69,40.52) v1(17.7,38.86) v1(17.72,23.74) v1(17.82,20.19) v1(18.36,44.84) v1(19.05,19.92) v1(19.19,44.84) v1(19.09,28.53) v1(19.22,23.45) v1(19.21,13.59) v1(20.23,34.8) v1(20.93,4.27) v1(20.93,3.51) v1(20.93,2.87) v1(20.93,2.14) v1(21.22,44.84) v1(21.64,4.27) v1(21.64,3.51) v1(21.64,2.87) v1(21.63,2.14) v1(21.88,34.55) v1(21.82,33.41) v1(21.85,16.68) v1(22.14,27.82) v1(22.26,0.67) v1(22.34,2.14) v1(22.3,1.42) v1(22.66,34.51) v1(23,4.9) v1(23.04,2.14) v1(23.04,1.43) v1(23,0.68) v1(23.53,20.07) v1(23.71,4.9) v1(23.75,2.14) v1(23.76,0.68) v1(23.8,1.43) v1(24.45,40.15) v1(24.43,39.13) v1(24.46,38.27) v1(24.49,37.47) v1(24.42,4.9) v1(24.46,4.27) v1(24.46,3.51) v1(24.46,2.87) v1(24.46,2.14) v1(24.56,1.43) v1(24.52,0.68) v1(24.68,9.79) v1(24.68,9.03) v1(24.68,6.61) v1(24.68,5.85) v1(24.72,10.42) v1(24.71,7.36) v1(25.17,3.51) v1(25.17,2.87) v1(25.16,2.14) v1(25.19,1.4) v1(25.18,0.64) v1(25.31,40.26) v1(25.34,37.94) v1(25.82,19.18) v1(26.15,1.92) v1(26.12,0.92) v1(26.77,20.7) v1(26.77,19.97) v1(26.7,19.18) v1(26.7,18.43) v1(26.84,44.68) v1(26.84,43.82) v1(26.84,42.21) v1(27.29,1.92) v1(27.29,0.92) v1(27.35,43.19) v1(27.4,25.75) v1(27.4,24.89) v1(27.4,24.06) v1(27.4,23.16) v1(27.4,22.23) v1(27.4,21.43) v1(27.47,20.71) v1(27.47,19.94) v1(27.47,18.42) v1(27.47,17.66) v1(27.49,19.18) v1(27.65,34.43) v1(27.73,44.2) v1(28.05,24.89) v1(28.05,24.06) v1(28.05,23.16) v1(28.05,22.23) v1(28.05,21.43) v1(28.11,42.55) v1(28.15,41.81) v1(28.23,43.44) v1(28.45,44.68) v1(28.74,37.98) v1(29,43.69) v1(29.25,39.93) v1(29.5,37.98) v1(29.76,34.42) v1(29.87,44.68) v1(29.94,42.65) v1(30.06,43.69) v1(30.27,37.6) v1(30.31,41.09) v1(30.38,19.34) v1(30.38,18.16) v1(30.52,34.42) v1(30.9,43.19) v1(30.9,42.42) v1(31.13,29.73) v1(31.28,41.53) v1(31.28,40.75) v1(31.28,40.01) v1(31.28,39.25) v1(31.27,38.37) v1(31.54,44.33) v1(31.92,42.42) v1(31.92,39.63) v1(32.04,41.15) v1(32.04,38.61) v1(32.17,43.44) v1(32.32,40.46) v1(32.57,41.6) v1(32.57,39.57) v1(32.95,38.8) v1(33.21,42.49) v1(33.5,29.73) v1(33.72,38.3) v1(34.35,43.12) v1(34.46,34.61) v1(35.49,43.38) v1(35.66,29.86) v1(36.51,43) v1(36.51,38.04) v1(37.27,38.68) v1(37.4,42.36) v1(37.83,29.86) v1(37.91,41.49) v1(37.91,40.44) v1(37.91,39.44) v1(40.05,30.36) v1(40.06,29.57) v1(40.06,28.77) v1(40.06,27.95) v1(40.68,29.85) v1(40.92,27.95) v1(41.44,29.22) v1(41.82,27.95) v1(42.08,28.58) v1(42.71,27.95) v2(22.69,17.66) v3(23.05,3.51) v4(26.01,26.42) v4(26.01,24.64) v4(26.01,21.98) v4(26.01,20.07) v5(21.23,1.08)
VBAT: length 5
  Top Layer w0.254: v1(17.13,7.63) v1(16.42,7.63) C18.2 arc(14.61,7.79) 14.45,7.86 U29.4 ; v1(17.31,10.47) R21.1
  vias: v1(15.03,4.83) v1(15.07,4.2) v1(15.07,3.43) v1(15.07,2.8) v1(15.07,2.06) v1(15.07,1.38) v1(15.03,0.64) v1(15.73,4.83) v1(15.77,4.2) v1(15.77,3.43) v1(15.77,2.8) v1(15.77,2.06) v1(15.77,0.65) v1(15.81,1.39) v1(16.42,6.86) v1(16.43,4.83) v1(16.47,2.06) v1(16.57,1.39) v1(16.53,0.65) v1(17.19,6.86) v1(17.14,4.83) v1(17.18,2.06) v1(17.33,1.39) v1(17.29,0.65) v1(17.85,4.83) v1(17.89,2.06) v1(17.94,7.63) v1(17.95,6.86) v1(18.55,4.83) v1(18.59,4.2) v1(18.59,3.43) v1(18.59,2.8) v1(18.59,2.06) v1(19.26,4.83) v1(19.3,4.2) v1(19.3,3.43) v1(19.3,2.8) v1(19.3,2.06) v3(17.18,3.43) v5(18.75,1.01)
ADC_CURRENT: length 11.6
  Top Layer w0.254: NOREF#13.1 12.05,10.29 R18.2 ; v2(15.53,16.52) 15.53,15.34 arc(15.53,15.34) U42.9
  L3 w0.254: v2(12.11,10.17) 13.88,10.17 arc(14.24,10.31) 14.39,10.67 14.39,15.37 arc(14.73,16.18) v2(15.53,16.52)
BUSY: length 7.7
  Top Layer w0.254: U35.16 21.19,36.99 19.32,36.99 18.09,35.76 16.73,35.76 15.43,37.06 U52.7
D+: length 15.5
  L3 w0.15: v1(7.19,29.04) 6.42,28.27 6.42,24.34 4.72,22.64 4.72,19.86 5.38,19.2 v2(6.42,19.2)
  Bottom Layer w0.254: v2(6.42,19.2) 7.34,19.2 U53.B6 arc(7.39,19.12) 7.44,19.1 7.94,19.1 arc(8.14,19.02) 8.22,18.82 8.22,18.52 arc(8.14,18.32) 7.94,18.24 7.44,18.24 arc(7.39,18.22) U53.A6
D-: length 16.6
  Top Layer w0.254: R47.1 7.16,29.91 v1(7.16,29.85)
  L3 w0.15: v2(6.44,17.8) 6.42,17.8 4.47,19.75 4.47,22.75 6.17,24.45 6.17,28.77 7.16,29.77 v1(7.16,29.85)
  Bottom Layer w0.254: 7.24,18.67 6.62,18.67 6.39,18.44 6.39,17.86 v2(6.44,17.8) 6.49,17.8 6.55,17.74 7.17,17.74 arc(7.22,17.72) 7.24,17.67
DIO1: length 7.8
  Top Layer w0.254: U52.8 15.93,37.07 16.88,36.11 17.94,36.11 19.17,37.35 19.53,37.35 19.99,37.8 19.99,38.36 20.36,38.73 21,38.73 21.02,38.74 U35.13
ELRS_AT: length 3
  Top Layer w0.254: RF1.1 17.88,43.76 FL1.3 NOREF#9.1
ESCINPCB: length 4.7
  Top Layer w0.254: NOREF#36.1 18.59,21.84 U42.26 21.99,21.84 22.74,22.59 R16.1
GIRO_MOSI: length 9.5
  Top Layer w0.254: 20.83,13.21 20.49,13.21 19.75,13.95 19.75,16.15 19.04,16.87 19.04,18.81 19.71,19.48 19.71,19.48 19.75,19.52 19.75,20.02 20.07,20.34 U42.23
GYRO_CS: length 6.3
  Top Layer w0.254: U42.20 20.96,18.77 20,18.77 19.75,18.52 19.75,17.16 20.47,16.44 20.47,14.5 20.74,14.23 20.96,14.23 U43.12
GYRO_MISO: length 18.3
  Top Layer w0.254: U42.22 22.3,19.84 v1(22.65,19.49) ; U43.1 21.13,11.82 arc(21.06,11.64) 20.88,11.56 v1(20.66,11.56)
  L3 w0.254: v1(22.65,19.49) 23.48,19.49 arc(23.97,19.29) 24.17,18.8 24.17,16.01 arc(24.36,15.56) 24.81,15.37 arc(25.25,15.19) 25.44,14.74 25.44,12.45 arc(24.96,11.28) 23.79,10.8 21.42,10.8 arc(20.88,11.02) v1(20.66,11.56)
GYRO_SCK: length 7.7
  Top Layer w0.254: U43.13 20.64,13.72 20.56,13.81 20.55,13.81 20.11,14.25 20.11,16.3 19.4,17.01 19.4,18.66 19.86,19.12 19.86,19.12 20.07,19.34 U42.21
HO1: length 12.6
  Top Layer w0.254: NOREF#10.1 34.08,25.41 v1(34.2,25.28)
  L3 w0.254: v1(39.37,19.51) 39.37,22.74 arc(38.62,24.53) 36.83,25.28 v1(34.2,25.28)
HO2: length 13.1
  Top Layer w0.254: NOREF#34.1 33.06,20.45 v1(34.2,19.31)
  L3 w0.254: v1(34.2,19.31) 36.36,19.31 arc(37.53,18.83) 38.01,17.66 38.01,14.46 arc(38.39,13.54) v1(39.31,13.16)
HO3: length 18.4
  L3 w0.254: v1(29.53,3) 29.53,11.69 arc(29.51,11.69) 29.5,11.71 29.5,13.98 arc(29.36,14.33) 29,14.48 v1(26.46,14.48)
  Bottom Layer w0.254: R3.1 30.98,4.45 arc(30.55,3.43) v1(29.53,3)
LED: length 0.8
  Top Layer w0.254: U35.14 21.39,38.2 v2(20.64,38.2)
LO1: length 1.3
  Top Layer w0.254: 35.35,26.29 36.06,26.29 R4.1
LO2: length 1.2
  Top Layer w0.254: 35.35,13.34 36.44,13.34 arc(36.47,13.33) 36.48,13.3
LO3: length 10.7
  Top Layer w0.254: R6.1 27.72,8.12 arc(28.13,9.12) 29.12,9.53 arc(30.47,10.09) 31.03,11.44 NOREF#4.1
MAIN_D+: length 7.8
  Top Layer w0.15: R48.2 8.5,28.91 arc(8.71,29) 8.8,29.22 arc(8.92,29.48) 9.18,29.6 12.36,29.6 arc(12.81,29.41) 12.99,28.96 12.99,26.87 arc(13.01,26.85) U42.45
MAIN_D-: length 8
  Top Layer w0.15: U42.44 13.53,28.3 arc(13.52,28.35) 13.52,28.39 13.52,28.84 arc(13.13,29.56) 12.36,29.85 8.41,29.85 arc(8.24,29.88) R47.2
MISO: length 3.2
  Top Layer w0.254: U35.12 21.02,39.24 20.86,39.08 20.37,39.08 19.7,39.75 U52.16
MOSI: length 2.9
  Top Layer w0.254: U52.17 21.43,40.25 arc(21.44,40.25) U35.10
NRST: length 15.2
  Top Layer w0.254: U35.6 23.17,42.28 v2(23.15,42.3) ; U52.3 13.7,39.75 13.47,39.97 v2(13.17,39.97)
  Bottom Layer w0.254: v2(13.17,39.97) 13.17,40.82 arc(13.31,41.15) 13.63,41.28 19.34,41.28 arc(19.79,41.47) 19.98,41.92 19.98,42.42 arc(20.17,42.87) 20.61,43.06 22.27,43.06 arc(22.86,42.85) v2(23.15,42.3)
NSS: length 4.5
  Top Layer w0.254: U35.8 21.87,41.17 18.17,41.17 U52.19
RX2(ELRS): length 24.2
  Top Layer w0.15: R64.2 29.07,34.37 arc(28.75,33.6) 27.98,33.28 27.22,33.28 arc(26.41,32.94) 26.08,32.14 26.08,31.23 arc(25.38,29.53) v2(23.69,28.83)
  L3 w0.15: v2(20.43,17.23) 20.43,19.44 arc(20.8,20.33) 21.7,20.71 21.88,20.71 arc(23.05,21.19) 23.54,22.36 23.54,28.69 v2(23.69,28.83)
RX3: length 4.9
  Top Layer w0.254: U42.52 9.49,23.37 8.17,23.37 7.41,24.14 5.15,24.14 UART3.4
RX4: length 15.8
  Top Layer w0.254: U42.15 18.53,16.3 17.3,17.53 11.76,17.53 10.72,16.49 5.73,16.49 arc(5.24,16.69) UART4.4
RX5(ESC): length 19.2
  Top Layer w0.254: U42.54 10.35,22.34 arc(10.69,22.19) 10.84,21.85 10.84,20.96 arc(10.98,20.6) 11.34,20.45 13.88,20.45 arc(14.24,20.3) 14.39,19.94 14.39,19.06 arc(14.5,18.79) 14.77,18.67 18.26,18.67 arc(18.4,18.62) v1(18.46,18.48)
  Bottom Layer w0.254: v1(18.46,18.48) 21.19,18.48 21.63,18.04 22.32,18.04 22.47,18.19 22.9,18.19 23.86,17.23 v4(25.17,17.23)
RX6: length 21.5
  Top Layer w0.254: U42.38 16.53,25.55 arc(16.49,25.49) 16.44,25.44 arc(16.39,25.44) v1(16.38,25.48)
  L3 w0.254: v1(16.38,25.48) 16.06,25.48 13.17,22.59 11.5,22.59 10.2,23.89 10.2,31.12 9.82,31.5 6.42,31.5 v1(5.8,30.89)
SCK: length 2.9
  Top Layer w0.254: U52.18 21.43,40.75 arc(21.44,40.75) U35.9
SERVO: length 7.7
  Top Layer w0.254: v2(15.7,18.06) 14.78,18.06 arc(14.77,18.06) 14.77,18.06 arc(14.25,18.28) 14.04,18.8 14.04,18.83 arc(14.02,18.94) 14.01,19.06 14.01,19.59 arc(13.86,19.95) 13.5,20.1 10.78,20.1 10.54,20.34 U42.58
TX2(ELRS): length 34.2
  Top Layer w0.15: U35.27 26.95,38.24 arc(27.23,38.13) 27.35,37.85 27.35,36.84 arc(27.42,36.66) 27.6,36.58 arc(28.23,36.32) 28.49,35.69 28.49,34.04 arc(28.41,33.86) 28.23,33.79 26.58,33.79 arc(25.95,33.53) 25.69,32.9 25.69,30.99 arc(25.25,29.92) 24.17,29.47 23.54,29.47 arc(23.18,29.32) v2(23.03,28.96)
  L3 w0.15: v2(17.81,17.89) 17.81,16.53 arc(18,16.07) 18.46,15.88 19.34,15.88 arc(19.61,15.99) 19.73,16.26 19.73,19.82 arc(20.13,20.81) 21.12,21.21 21.25,21.21 arc(22.42,21.7) 22.9,22.87 22.9,28.84 arc(23.04,28.82) v2(23.03,28.96)
  Bottom Layer w0.15: v2(17.81,17.89) 17.81,17.57 arc(17.72,17.36) 17.51,17.28
TX3: length 5
  Top Layer w0.254: UART3.3 7.38,25.03 8.57,23.84 U42.51
TX4: length 18.8
  Top Layer w0.254: UART4.3 4.24,18.17 arc(3.87,18.02) 3.72,17.66 3.72,16.9 arc(3.95,16.36) 4.49,16.13 10.87,16.13 11.89,17.15 17.17,17.15 18.03,16.29 U42.14
TX6: length 22.3
  Top Layer w0.254: v1(17.16,25.5) 17.16,25.75 17.03,25.88 U42.37
  L3 w0.254: v1(17.16,25.5) 16.97,25.69 16.97,25.72 16.62,26.07 16.14,26.07 13.02,22.95 11.64,22.95 10.58,24.01 10.58,31.24 9.96,31.87 v1(5.7,31.87)
VM: length 25.9
  Top Layer w0.254: U29.5 14.59,8.51 arc(14.6,8.47) v1(14.56,8.45) ; v1(8.72,33.13) 12.26,33.13 arc(13.71,32.6) v1(14.32,31.19)
  L3 w0.254: v1(14.56,8.45) 26.33,8.45 arc(28.13,9.19) 28.87,10.99 v1(28.87,13.34)
  vias: v1(14.03,30.12) v1(14.14,29.34) v1(14.5,28.72) v1(14.61,30.49) v1(14.85,29.32) v1(24.55,34.34) v1(29.89,32.14) v1(30.27,32.64) v1(30.64,31.28) v1(30.95,31.86) v1(31.31,31.32) v1(31.41,27.18) v1(32.31,27.19) v1(33.14,27.2) v1(33.14,26.46) v1(34.02,27.2) v1(34.01,26.53) v1(34.71,27.31) v1(36.69,27.19)
VOL_BAT: length 4.6
  Top Layer w0.254: R21.2 R20.2 16.3,13.59 arc(16.18,13.86) 15.92,13.98 15.53,13.98 arc(15.18,14.12) 15.03,14.48 U42.8
VS1: length 6.6
  Top Layer w0.254: Q12.9 40.51,21.93 38.14,19.56 35.64,19.56
  vias: v1(40.33,22.22) v1(40.46,23.74) v1(40.42,22.97) v1(40.5,24.49) v1(41.07,22.22) v1(41.16,22.97) v1(41.24,24.5) v1(41.2,23.75) v1(41.77,22.22) v1(41.77,21.46) v1(41.77,20.7) v1(41.86,22.97) v1(41.93,24.5) v1(41.9,23.75) v1(42.79,22.97) v1(42.7,22.22) v1(42.7,21.46) v1(42.7,20.7) v1(42.86,24.5) v1(42.83,23.75) v1(43.57,22.24) v1(43.57,21.48) v1(43.57,20.72) v1(43.65,22.99) v1(43.73,24.52) v1(43.69,23.77)
VS2: length 5.7
  Top Layer w0.254: 35.63,17.73 36.31,17.73 36.32,17.72 39.6,17.72 40.57,16.75 40.57,16.38
  vias: v1(40.25,17.38) v1(40.26,16.62) v1(40.25,15.86) v1(40.33,18.16) v1(41.05,17.38) v1(41.06,16.62) v1(41.05,15.86) v1(41.13,18.16) v1(41.88,18.17) v1(41.8,17.39) v1(41.81,16.63) v1(41.8,15.86) v1(41.8,15.1) v1(42.64,17.43) v1(42.65,16.67) v1(42.64,15.91) v1(42.64,15.14) v1(42.71,18.21) v1(43.37,17.4) v1(43.38,16.64) v1(43.37,15.88) v1(43.37,15.12) v1(43.44,18.19) v1(44.16,17.38) v1(44.17,16.63) v1(44.16,15.86) v1(44.16,15.1) v1(44.24,18.17)
VS3: length 7.6
  Top Layer w0.254: 30.33,6.36 30.77,6.36 arc(31.7,6.53) 32.49,7.03 arc(33.1,7.88) 33.31,8.9 NOREF#6.1
  vias: v1(39.54,10.04) v1(40.05,10.67) v1(40.17,9.47) v1(40.55,11.31) v1(40.68,10.1) v1(40.81,8.83) v1(41.06,11.94) v1(41.19,10.74) v1(41.32,9.47) v1(41.32,8.32) v1(41.57,12.45) v1(41.7,11.37) v1(41.82,10.1) v1(41.82,8.96) v1(42.2,11.88) v1(42.33,10.74) v1(42.33,9.59) v1(42.84,11.25) v1(42.84,10.23) v1(43.35,10.74)
$1N2538: length 3.2
  Top Layer w0.254: C51.2 18.33,13.59 arc(18.22,13.86) 17.95,13.98 arc(17.65,14.1) 17.53,14.39 U42.13
$1N3159: length 3.2
  Top Layer w0.254: R40.1 15.28,13.47 arc(15.21,13.65) 15.03,13.72 14.9,13.72 arc(14.63,13.83) 14.52,14.1 14.52,15.33 arc(14.52,15.33) U42.7
$1N3199: length 3.8
  Top Layer w0.254: 20.14,26.56 20.14,25.68 19.85,25.39 19.79,25.39 19.54,25.14 19.54,24.64 19.79,24.39 20.98,24.39 U42.31
$1N3225: length 1.7
  Top Layer w0.254: 12.08,28.52 12.08,26.89 U42.47
$1N3354: length 5.1
  Top Layer w0.254: 7.79,19.64 8.09,19.34 U42.60 10.83,19.34 arc(11.03,19.26) v1(11.11,19.06)
  Bottom Layer w0.254: v1(11.11,19.06) 9.87,19.06 arc(9.74,19.11) 9.69,19.23
$1N3523: length 2.7
  Top Layer w0.254: 14.07,12.71 14.07,15.3 arc(14.06,15.33) U42.6
$1N3528: length 4.2
  Top Layer w0.254: 11.67,12.71 11.67,13.41 arc(11.76,13.63) 11.98,13.72 13.12,13.72 arc(13.39,13.83) 13.5,14.1 13.5,15.31 arc(13.51,15.33) U42.5
$1N3909: length 1.3
  Top Layer w0.254: 6.95,17.4 6.66,17.11 v2(6.51,17.11)
  Bottom Layer w0.254: 7.24,17.17 6.62,17.17 6.56,17.11 v2(6.51,17.11)
$1N14327: length 3
  Bottom Layer w0.254: U53.B5 9.03,20.17 9.69,20.83 R42.1
$1N15412: length 1.9
  Top Layer w0.254: R43.2 18.13,29.6 LED6.2
$1N15413: length 2.7
  Top Layer w0.254: 17.38,28.85 16.86,28.33 16.57,28.33 16.1,27.87 16.1,27.57 16.03,27.5 U42.39
$1N25112: length 2.2
  Top Layer w0.254: v2(18.51,17.27) 18.68,17.1 18.68,16.72 19.03,16.37 U42.16
$1N25141: length 36.7
  Top Layer w0.15: v1(24.17,24.64) 24.17,26.42 arc(24.47,27.14) 25.19,27.44 26.96,27.44 arc(27.32,27.59) 27.47,27.95 27.47,28.07 arc(27.58,28.34) 27.85,28.45 37.12,28.45 arc(38.09,28.86) 38.5,29.83 38.5,31.6 38.52,31.63
  L3 w0.15: v2(17.11,18.15) 17.11,16.44 arc(17.18,16.3) 17.21,16.13 arc(17.26,15.87) 17.4,15.64 arc(17.6,15.54) 17.82,15.5 20.23,15.5 arc(20.95,15.8) 21.25,16.52 21.25,19.44 arc(21.47,19.98) 22.01,20.2 arc(23.54,20.83) 24.17,22.36 v1(24.17,24.64)
$1N27338: length 3.9
  Bottom Layer w0.4: 7.24,16.02 6.77,16.02 6.58,16.21 6.49,16.21 6.22,16.48 6.1,16.48 6.07,16.52 5.5,16.52 ; 5.63,20.07 6.19,20.63 6.61,20.63 6.65,20.67 7.09,20.67 7.24,20.82
$2N4139: length 1.3
  Top Layer w0.254: 13.56,9.16 13.56,9.65 arc(13.41,10.01) R18.1
$2N14711: length 1.3
  Bottom Layer w0.254: R37.1 11.16,37.69 11.6,38.12
$2N35678: length 3.4
  Bottom Layer w0.254: R58.1 11.97,29.83 arc(11.87,30.37) 11.6,30.84 arc(11.47,31.06) 11.23,31.16 arc(10.83,31.35) U58.2
$2N37520: length 5.4
  Bottom Layer w0.254: 24.62,32.37 25.13,32.37 25.32,32.56 25.96,32.56 U59.2 26.35,32.7 26.43,32.62 26.99,32.62 27.57,32.05 27.57,31.87 27.83,31.61 27.83,31.61 28.01,31.43 28.01,30.28 R62.1
$2N37530: length 1.6
  Bottom Layer w0.254: U59.3 26.04,33.4 R61.1
$2N43695:
  vias: v1(16.08,34.78) v1(16.09,34.13) v1(16.84,34.78) v1(16.84,34.13) v1(19.98,33.66) v1(19.98,33.03) v1(20.64,33.72) v1(20.61,33.03)
$3N23575: length 1.6
  Bottom Layer w0.254: 40.75,20.81 40.75,20.09 arc(40.72,19.92) 40.65,19.76 arc(40.46,19.69) 40.32,19.53 arc(40.25,19.52) R1.2
$3N23610: length 5.7
  Top Layer w0.254: R4.2 arc(37.64,25.74) 37.76,25.46 37.76,21.66 arc(37.51,21.06) 36.91,20.81
$3N23669: length 1.5
  Bottom Layer w0.254: Q8.4 40.68,13.67 arc(40.68,13.61) 40.67,13.54 arc(40.63,13.47) 40.6,13.4 arc(40.42,13.22) R2.2
$3N23722: length 1.5
  Top Layer w0.254: R5.2 37.34,13.99 arc(37.2,14.33) 36.85,14.48
$3N23784: length 1.4
  Bottom Layer w0.254: R3.2 31.84,7.5 arc(31.83,7.54) Q9.4
$3N23789: length 1.3
  Top Layer w0.254: 26.73,4.45 26.73,3.39 arc(26.77,3.3) R6.2
$3N32793: length 3.6
  Top Layer w0.254: R16.2 22.79,23.55 25.77,23.55 arc(25.99,23.46) NOREF#35.1
$4N1414: length 2.6
  Top Layer w0.254: U35.1 25.67,44.03 AE1.1
$4N1415:
  vias: v2(24.84,42.27)
$4N1425: length 2.3
  Top Layer w0.254: v2(22.18,42.22) 22.32,42.08 22.42,42.08 22.59,41.91 22.59,41.81 22.67,41.73 U35.7
  Bottom Layer w0.254: v2(22.18,42.22) 22.15,42.25 C28.1
$4N1429: length 5.5
  Top Layer w0.254: U35.30 27.71,39.74 arc(27.99,39.86) 28.11,40.14 28.11,40.77 arc(28.2,41) 28.43,41.09 X1.1 29.21,42.54 arc(29.18,42.61) C96.2
$4N1434: length 6.3
  Top Layer w0.254: U35.29 27.73,39.24 arc(27.91,39.17) 27.98,38.99 arc(28.09,38.73) 28.36,38.61 29.5,38.61 arc(30.09,39.02) X1.3 30.31,38.4 arc(30.32,38.38) C97.1
$4N1450: length 1.1
  Top Layer w0.254: 22.61,35.44 22.67,35.5 U35.18
$4N16826: length 1.2
  Top Layer w0.254: FL1.1 16.43,42.61 U52.22
$4N18055: length 9.6
  Top Layer w0.254: v2(20.66,37.52) 20.85,37.52 21,37.66 21.36,37.66 U35.15 ; v1(23.6,34.42) 23.6,32.12 SW3.1
  Bottom Layer w0.254: v2(20.66,37.52) 20.96,37.22 23.54,37.22 23.92,36.84 23.92,34.74 v1(23.6,34.42)
$4N19180: length 1
  Top Layer w0.254: v2(19.32,38.29) 19.23,38.38 19.23,38.58 19.05,38.75 U52.14
$4N19324: length 1.7
  Top Layer w0.254: v2(13.88,40.39) 14.02,40.25 U52.2 ; v2(18.12,37.04) 17.89,37.26 17.89,37.44 17.99,37.53 arc(17.97,37.58) U52.12
$4N19361: length 1.2
  Top Layer w0.254: U52.4 13.72,39.25 C98.2
$4N19425: length 1.5
  Top Layer w0.254: U57.3 12.35,38.32 C98.1
$4N27786: length 3.7
  Top Layer w0.15: U35.28 26.83,38.74 arc(27.64,38.41) 27.98,37.6 arc(28.17,37.13) 28.64,36.94 R64.1

## Copper pours and planes (outline as drawn; the poured copper is in the pictures)
3.3V-ESP32 on Top Layer: 11.72,42.22 12.74,42.22 12.74,39.76 11.72,39.76
3.3V-ESP32 on Bottom Layer: 21.84,41.57 21.84,40.88 21.09,40.14 20.11,40.14 20.11,38.99 22.01,38.99 23.54,40.52 23.79,40.52 23.79,41.41 23.63,41.57
3.3V-ESP32 on Bottom Layer: 24.59,41.63 27.74,41.63 27.74,41.07 24.59,41.07
3.3V-ESP32 on Bottom Layer: 21.44,40.51 23.92,40.51 23.92,38.66 21.44,38.66
3.3V-ESP32 on Bottom Layer: 10.79,25.46 15.67,25.46 15.67,24.14 10.79,24.14
3.3V-ESP32 on L3: 26.49,41.63 27.74,41.63 27.74,40.69 26.49,40.69
3.3V-ESP32 on L3: 11.86,36.87 11.86,35.48 26.54,35.48 26.69,35.58 26.71,36.07 27.06,36.42 27.06,41.68 25.24,41.68 25.24,36.76 17.66,36.76 17.56,36.87
3.3V-ESP32 on L3: 11.22,24.01 11.05,24.17 11.03,24.17 11.03,37.46 11.85,38.28 11.85,42.17 11.98,42.3 12.64,42.3 12.64,42.27 12.74,42.17 12.74,38.38 13.38,37.74 13.38,30.32 12.81,29.76 12.81,24.21 12.61,24.01
3.3V-ESP32 on L3: 11,25.53 12.76,25.53 12.76,23.88 11,23.88
3.3V-MCU on Top Layer: 9.56,28.2 11.52,28.2 11.52,25.86 9.56,25.86
3.3V-MCU on Top Layer: 19.96,26.95 22.52,26.95 22.52,24.82 19.96,24.82
3.3V-MCU on Top Layer: 11.07,22.22 14.63,22.22 14.63,20.61 11.07,20.61
3.3V-MCU on Top Layer: 22.47,16.95 22.99,16.95 22.99,14.81 22.47,14.81
3.3V-MCU on Top Layer: 23.23,13.37 23.92,13.37 23.92,11.18 23.23,11.18
3.3V-MCU on Bottom Layer: 11.23,22.22 15.62,22.22 15.62,20.83 11.23,20.83
4V-MCU on Bottom Layer: 21.38,25.91 5.12,25.91 5.12,16.9 4.27,16.9 4.27,17.11 4.1,17.28 4.1,33.4 5.37,33.4 5.5,33.27 5.5,28.75 6.62,27.63 20.3,27.63 20.42,27.76 21.38,26.8
4V-MCU on Bottom Layer: 17.22,28.71 23.03,28.71 23.03,20.51 17.22,20.51
4V-MCU on Bottom Layer: 4.69,26.28 8.41,26.28 8.41,19.82 4.69,19.82
4V-MCU on Bottom Layer: 3.14,19.74 4.53,19.74 4.53,18.67 3.14,18.67
4V-MCU on Bottom Layer: 10.72,29.16 11.28,29.16 11.28,27.15 10.72,27.15
6V-SV on Top Layer: 31.11,37.48 34.91,37.48 34.91,35.31 31.11,35.31
6V-SV on Top Layer: 33.78,37.48 39.54,37.48 39.54,33.03 33.78,33.03
6V-SV on Bottom Layer: 27.17,37.47 34.97,37.47 34.97,35.11 27.17,35.11
8V on Top Layer: 28.36,20.83 30.14,20.83 30.14,18.76 28.36,18.76
8V on Bottom Layer: 28.15,20.67 30.95,20.67 30.95,19.8 28.15,19.8
GND on Top Layer: 43.98,27.44 23.8,27.44 23.8,10.89 20.11,7.19 20.11,0.08 -2.96,0.08 -3.26,0.39 -3.26,48.01 -3.52,48.27 42.59,48.27 43.98,46.87
GND on Top Layer: 24.68,26.97 24.68,23.8 24.17,23.29 24.17,11.73 19.85,7.41 19.85,0.23 27.7,0.23 27.85,0.39 27.85,2.34 26.28,2.34 26.2,2.42 26.2,5.1 27.87,5.1 27.98,5.21 27.98,8.95 28.49,9.46 32.18,9.46 32.18,9.86 34.7,12.37 37.76,12.37 38.27,12.88 38.27,27.31 37.92,26.97
GND on Bottom Layer: 37.13,37.97 39.66,37.97 39.66,35.44 37.13,35.44
GND on Bottom Layer: -0.34,45.6 45.76,45.6 45.76,-2.15 -0.34,-2.15
GND on Bottom Layer: 25.43,27.44 28.36,27.44 28.36,19.22 25.43,19.22
GND on Bottom Layer: 20.11,4.96 25.44,4.96 25.44,0.39 20.11,0.39
GND on L2: 23.54,30.87 23.54,10.38 20.08,6.92 20.08,0.41 20.11,0.39 35.73,0.39 35.85,0.26 44.87,9.28 44.87,27.06 40.96,30.87
GND on L2: 40.3,31.25 23.18,31.25 23.18,9.45 20.59,6.86 20.36,6.86 20.36,0.45 0.61,0.45 0.42,0.64 0.42,41.53 4.49,45.6 35.98,45.6 39.79,41.79 39.79,31.76
GND on L2: 37.13,37.97 39.66,37.97 39.66,35.44 37.13,35.44
GND on L3: 24.68,26.43 24.68,12.59 20.14,8.04 20.14,-0.85 20.11,-0.88 45,-0.88 45,27.06 25.32,27.06
GND on L3: 45.13,27.31 23.92,27.31 23.92,12.52 20.49,9.09 20.49,-1.01 -1.36,-1.01 -1.36,45.6 -0.72,46.23 40.55,46.23 45.13,41.66
GND on L3: 37.1,38 39.69,38 39.69,35.41 37.1,35.41
VBAT on Top Layer: 15.79,8.9 15.79,6.74 14.9,5.85 14.65,5.85 14.65,0.51 14.77,0.39 19.22,0.39 19.34,0.26 19.6,0.51 19.6,5.09 18.58,6.1 18.58,8.77 18.46,8.9
VBAT on Bottom Layer: 14.77,16.39 23.92,16.39 23.92,5.21 14.77,5.21
VBAT on Bottom Layer: 14.65,8.13 19.73,8.13 19.73,0.13 14.65,0.13
(no net) on Top Layer: 10.58,13.59 14.66,13.59 14.66,11.42 10.58,11.42
(no net) on Bottom Layer: 21.88,45.22 26.34,45.22 26.34,42.89 21.88,42.89
(no net) on L2: 21.88,45.22 26.33,45.22 26.33,43.06 21.88,43.06
(no net) on L3: 28.99,31.7 30.17,31.7 30.22,31.71 30.23,31.76 30.42,31.83 30.5,32.02 30.5,33.2 30.19,33.2 29.35,32.85 29,32.01 28.99,32.01
(no net) on L3: 21.88,45.09 26.34,45.09 26.34,42.89 21.88,42.89
LED on Bottom Layer: 21.57,38.9 23.92,38.9 23.92,37.66 21.57,37.66
LED on Bottom Layer: 20.23,38.91 22.01,38.91 22.01,38.07 20.23,38.07
VM on Top Layer: 29.44,32.4 31.54,32.4 31.54,30.99 29.44,30.99
VM on Top Layer: 13.89,31.16 14.9,31.16 14.9,28.39 13.89,28.39
VM on Top Layer: 30.01,32.9 29.37,32.25 29.37,31.75 31.51,31.75 31.51,33.55 30.86,32.9
VM on Bottom Layer: 25.45,16.39 30.52,16.39 30.52,3.94 25.45,3.94
VM on Bottom Layer: 27.85,32.89 30.6,32.89 30.6,31.76 27.85,31.76
VM on Bottom Layer: 26.7,27.57 39.28,27.57 39.28,12.64 26.7,12.64
VM on Bottom Layer: 12.11,31.5 14.9,31.5 14.9,29.85 12.11,29.85
VM on L3: 24.05,34.78 25.05,34.78 25.05,32.89 24.05,32.89
VM on L3: 12.99,29.44 13.05,27.69 16.78,27.69 18.33,29.24 18.33,30.1 23.85,30.1 28.29,25.66 37.51,25.66 37.89,26.04 37.89,31.6 35.82,33.66 17.81,33.66 15.15,30.1
VS1 on Top Layer: 38.27,19.56 38.27,26.93 38.52,27.18 43.95,27.18 44.78,26.35 44.78,19.56
VS1 on Bottom Layer: 39.74,24.86 39.74,21.34 41.19,21.34 41.57,20.96 41.57,19.69 44.77,19.69 44.77,24.74 44.62,24.9 39.77,24.9
VS2 on Top Layer: 38.68,18.86 38.68,13.56 38.78,13.47 44.49,13.47 44.74,13.72 44.74,19.41 38.8,19.41 38.65,19.56 38.65,18.89
VS2 on Bottom Layer: 39.54,15.12 41.32,15.12 42.08,14.36 42.08,14.23 44.74,14.23 44.74,19.44 39.54,19.44
VS3 on Top Layer: 28.34,8.57 28.34,-0.25 46.78,-0.25 47.54,0.51 47.54,13.21 47.44,13.31 37.98,13.31 37.98,11.17 33.51,11.17 32.67,10.33 32.67,8.57
VS3 on Bottom Layer: 29.63,13.86 46.9,13.86 46.9,-1.9 29.63,-1.9
$1N2538 on Top Layer: 17.98,13.01 19.87,13.01 19.87,12.32 17.98,12.32
$1N27338 on Bottom Layer: 5.36,0.58 5.37,1.03 5.41,1.93 5.49,2.82 5.61,3.71 5.77,4.59 5.97,5.47 6.2,6.33 6.48,7.19 6.8,8.03 7.15,8.85 7.54,9.66 7.97,10.45 8.43,11.22 8.92,11.97 9.45,12.7 10.01,13.4 10.6,14.08 11.22,14.72 11.87,15.34 12.54,15.94 13.24,16.49 13.97,17.02 14.72,17.52 15.49,17.98 16.28,18.4 17.09,18.79 17.91,19.14 18.75,19.46 19.61,19.74 20.47,19.98 21.35,20.18 22.23,20.34 23.12,20.46 24.01,20.54 24.91,20.58 25.36,20.58 -14.12,20.58 -13.67,20.58 -12.77,20.54 -11.88,20.46 -10.99,20.34 -10.11,20.18 -9.23,19.98 -8.37,19.74 -7.51,19.46 -6.67,19.14 -5.85,18.79 -5.04,18.4 -4.25,17.98 -3.48,17.52 -2.73,17.02 -2,16.49 -1.3,15.94 -0.62,15.34 0.03,14.72 0.65,14.08 1.24,13.4 1.8,12.7 2.32,11.97 2.82,11.22 3.28,10.45 3.7,9.66 4.09,8.85 4.45,8.03 4.76,7.19 5.04,6.33 5.28,5.47 5.48,4.59 5.64,3.71 5.76,2.82 5.84,1.93 5.88,1.03 5.88,0.58 5.88,36.26 5.88,35.81 5.84,34.92 5.76,34.02 5.64,33.13 5.48,32.25 5.28,31.37 5.04,30.51 4.76,29.66 4.45,28.82 4.09,27.99 3.7,27.18 3.28,26.39 2.82,25.62 2.32,24.87 1.8,24.15 1.24,23.44 0.65,22.77 0.03,22.12 -0.62,21.5 -1.3,20.91 -2,20.35 -2.73,19.82 -3.48,19.33 -4.25,18.87 -5.04,18.44 -5.85,18.05 -6.67,17.7 -7.51,17.38 -8.37,17.11 -9.23,16.87 -10.11,16.67 -10.99,16.51 -11.88,16.39 -12.77,16.31 -13.67,16.27 -14.12,16.26 25.36,16.26 24.91,16.27 24.01,16.31 23.12,16.39 22.23,16.51 21.35,16.67 20.47,16.87 19.61,17.11 18.75,17.38 17.91,17.7 17.09,18.05 16.28,18.44 15.49,18.87 14.72,19.33 13.97,19.82 13.24,20.35 12.54,20.91 11.87,21.5 11.22,22.12 10.6,22.77 10.01,23.44 9.45,24.15 8.92,24.87 8.43,25.62 7.97,26.39 7.54,27.18 7.15,27.99 6.8,28.82 6.48,29.66 6.2,30.51 5.97,31.37 5.77,32.25 5.61,33.13 5.49,34.02 5.41,34.92 5.37,35.81 5.36,36.26
$1N27338 on Bottom Layer: 6.9,23.91 9.57,23.91 9.57,20.71 6.9,20.71
$2N34434 on Bottom Layer: 12.12,32.26 17.82,32.26 17.82,29.86 12.12,29.86
$2N34463 on Bottom Layer: 8.46,30.75 11.19,30.75 11.19,29.7 8.46,29.7
$2N34463 on Bottom Layer: 8.46,30.34 10.37,30.34 10.37,28.69 8.46,28.69
